# EAGLE design TSOP_to_DIP_adapter (EAGLE 7.6.0)
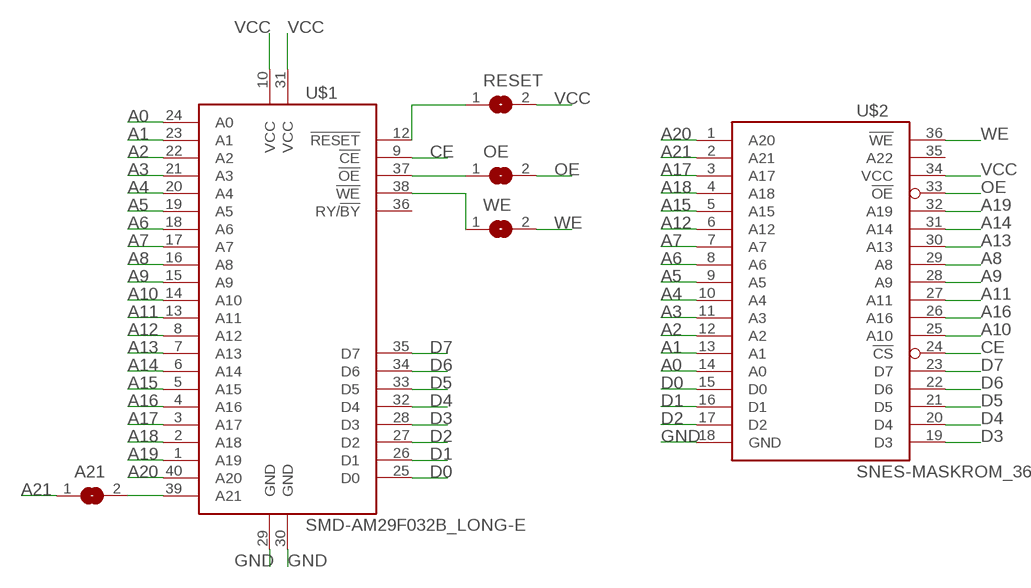
[diagram p0: schematic, sheet 1]

## Parts
A21  SMD-SOLDER_JUMPER_2  [SJ]
OE  SMD-SOLDER_JUMPER_2  [SJ]
RESET  SMD-SOLDER_JUMPER_2  [SJ]
U$1  SMD-AM29F032B_LONG-E  [40-TSOP_LONG]
U$2  SNES-MASKROM_36  [36-PDIP]
WE  SMD-SOLDER_JUMPER_2  [SJ]

## Nets
A0: U$1.24(A0) U$2.14(A0)
A1: U$1.23(A1) U$2.13(A1)
A2: U$1.22(A2) U$2.12(A2)
A3: U$1.21(A3) U$2.11(A3)
A4: U$1.20(A4) U$2.10(A4)
A5: U$1.19(A5) U$2.9(A5)
A6: U$1.18(A6) U$2.8(A6)
A7: U$1.17(A7) U$2.7(A7)
A8: U$1.16(A8) U$2.29(A8)
A9: U$1.15(A9) U$2.28(A9)
A10: U$1.14(A10) U$2.25(A10)
A11: U$1.13(A11) U$2.27(A11)
A12: U$1.8(A12) U$2.6(A12)
A13: U$1.7(A13) U$2.30(A13)
A14: U$1.6(A14) U$2.31(A14)
A15: U$1.5(A15) U$2.5(A15)
A16: U$1.4(A16) U$2.26(A16)
A17: U$1.3(A17) U$2.3(A17)
A18: U$1.2(A18) U$2.4(A18)
A19: U$1.1(A19) U$2.32(A19)
A20: U$1.40(A20) U$2.1(A20)
A21: A21.1 U$2.2(A21)
CE: U$1.9(!CE) U$2.24(!CS)
D0: U$1.25(D0) U$2.15(D0)
D1: U$1.26(D1) U$2.16(D1)
D2: U$1.27(D2) U$2.17(D2)
D3: U$1.28(D3) U$2.19(D3)
D4: U$1.32(D4) U$2.20(D4)
D5: U$1.33(D5) U$2.21(D5)
D6: U$1.34(D6) U$2.22(D6)
D7: U$1.35(D7) U$2.23(D7)
GND: U$1.29(GND) U$1.30(GND) U$2.18(GND)
N$1: OE.1 U$1.37(!OE)
N$2: RESET.1 U$1.12(!RESET)
N$3: A21.2 U$1.39(A21)
N$4: U$1.38(!WE) WE.1
OE: OE.2 U$2.33(!OE)
VCC: RESET.2 U$1.10(VCC) U$1.31(VCC) U$2.34(VCC)
WE: U$2.36(!WE) WE.2
Unconnected: U$1.36(RY/!BY) U$2.35(A22)

## Library data of the parts
A21 OE RESET WE = !sanni:SMD-SOLDER_JUMPER_2: SMD solder JUMPER
U$1 = !sanni:SMD-AM29F032B_LONG: 32MBit 5V Flash ROM (4M x 8) Manufactured by AMD, Spansion
U$2 = !sanni:SNES-MASKROM_36: 36-pin SNES MaskROM

## Net classes
0 default: width 0.254 mm, drill 0.305 mm, clearance 0.203 mm

## Board
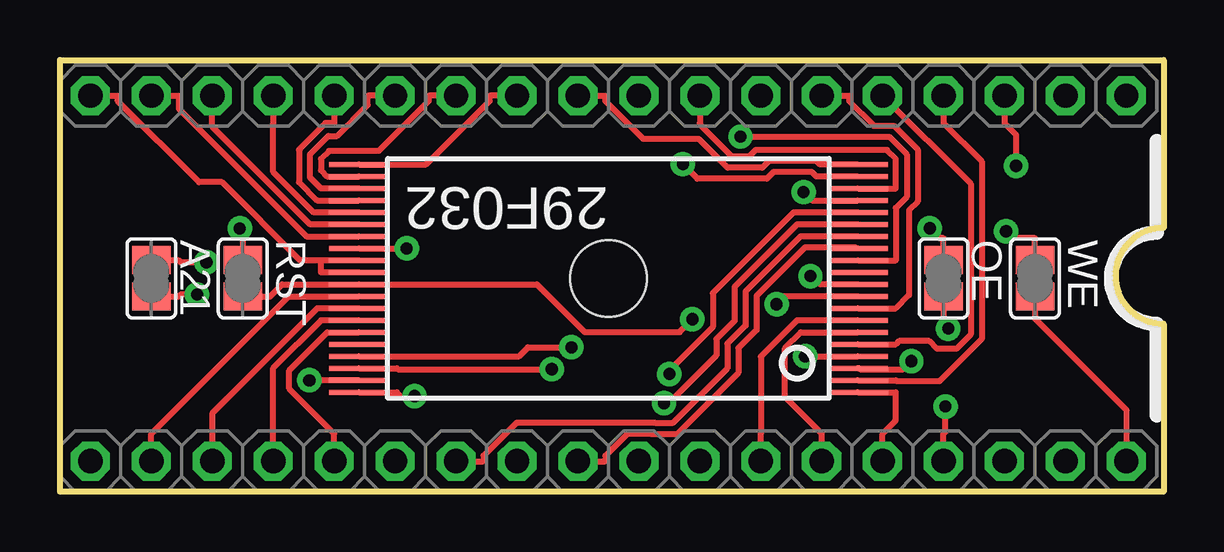
[diagram p1: board, top side]
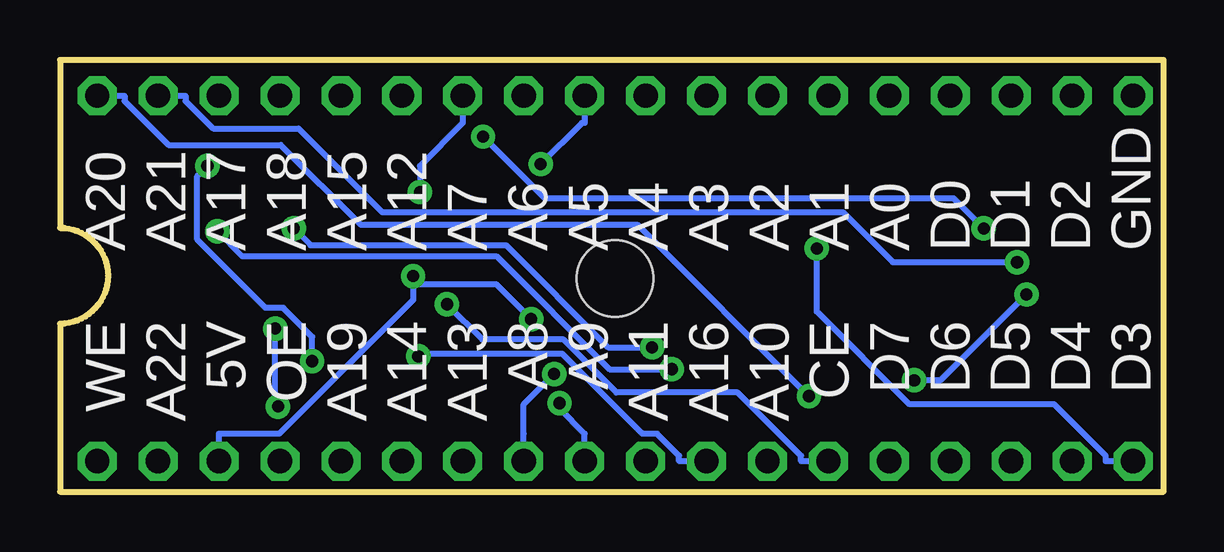
[diagram p2: board, bottom side, seen from below]

Size 46 x 18 mm. Coordinates in mm from the lower left corner, seen from the top.
Outline: 0,0 0,18 46,18 46,11 arc90 44,9 arc90 46,7 46,0 0,0
Copper layers (1*16): Top 0.035mm / dielectric 1.5mm / Bottom 0.035mm
Design rules "SparkFun_small": minimum track width 8mil, minimum drill 12mil, track to track 8mil, track to pad 8mil, pad to pad 8mil, via to via 8mil, smd to smd 8mil, copper to edge 20mil, drill to drill 12mil, minimum pad ring 12mil, minimum via ring 10mil, stop-mask expansion 4mil, vias tented up to drill 25mil, thermal gap 10mil
Holes 3.2 mm at 22.86,8.89

### Footprints (pad centres in the part's own frame; a part is rotated, then mirrored left to right if it is on the bottom)
SJ = smd 1.168 x 1.6: 1 -0.762,0; 2 0.762,0
40-TSOP_LONG = smd 2.5 x 0.2: 1 -10.4,4.75; 2 -10.4,4.25; 3 -10.4,3.75; 4 -10.4,3.25; 5 -10.4,2.75; 6 -10.4,2.25; 7 -10.4,1.75; 8 -10.4,1.25; 9 -10.4,0.75; 10 -10.4,0.25; 11 -10.4,-0.25; 12 -10.4,-0.75; 13 -10.4,-1.25; 14 -10.4,-1.75; 15 -10.4,-2.25; 16 -10.4,-2.75; 17 -10.4,-3.25; 18 -10.4,-3.75; 19 -10.4,-4.25; 20 -10.4,-4.75; 21 10.4,-4.75; 22 10.4,-4.25; 23 10.4,-3.75; 24 10.4,-3.25; 25 10.4,-2.75; 26 10.4,-2.25; 27 10.4,-1.75; 28 10.4,-1.25; 29 10.4,-0.75; 30 10.4,-0.25; 31 10.4,0.25; 32 10.4,0.75; 33 10.4,1.25; 34 10.4,1.75; 35 10.4,2.25; 36 10.4,2.75; 37 10.4,3.25; 38 10.4,3.75; 39 10.4,4.25; 40 10.4,4.75
36-PDIP = drill 1.016 octagon: 1 21.59,7.62; 2 19.05,7.62; 3 16.51,7.62; 4 13.97,7.62; 5 11.43,7.62; 6 8.89,7.62; 7 6.35,7.62; 8 3.81,7.62; 9 1.27,7.62; 10 -1.27,7.62; 11 -3.81,7.62; 12 -6.35,7.62; 13 -8.89,7.62; 14 -11.43,7.62; 15 -13.97,7.62; 16 -16.51,7.62; 17 -19.05,7.62; 18 -21.59,7.62; 19 -21.59,-7.62; 20 -19.05,-7.62; 21 -16.51,-7.62; 22 -13.97,-7.62; 23 -11.43,-7.62; 24 -8.89,-7.62; 25 -6.35,-7.62; 26 -3.81,-7.62; 27 -1.27,-7.62; 28 1.27,-7.62; 29 3.81,-7.62; 30 6.35,-7.62; 31 8.89,-7.62; 32 11.43,-7.62; 33 13.97,-7.62; 34 16.51,-7.62; 35 19.05,-7.62; 36 21.59,-7.62

### Placement (x,y rotation side)
A21  3.81,8.89 270 top
OE  36.83,8.89 270 top
RESET  7.62,8.89 270 top
U$1  22.86,8.89 180 top
U$2  22.86,8.89 0 top
WE  40.64,8.89 270 top

### Tracks (layer width: path | path; a pad name or v marks a point on that pad's centre or on a via)
A0
  Top 0.254: U$2.14 11.43,15.37 11.07,15.37 9.96,14.26 9.96,12.91 10.73,12.14 U$1.24
A1
  Top 0.254: U$2.13 12.83,16.51 12.83,16.12 11.54,14.83 11.19,14.83 10.42,14.07 10.42,13.1 10.88,12.64 U$1.23
A2
  Top 0.254: U$2.12 15.37,16.51 15.37,16.29 13.29,14.21 11.21,14.21 10.88,13.88 10.88,13.4 11.14,13.14 U$1.22
A3
  Top 0.254: U$2.11 17.91,16.51 17.91,16.29 15.26,13.64 U$1.21
A4
  Top 0.254: U$1.20 31.68,13.64 31.54,13.79 29.56,13.79 29.28,13.51 27.83,13.51 26.62,14.71 24.32,14.71 22.73,16.29 22.73,16.51 U$2.10
A5  (via drill 0.51 pad 1.02)
  Top 0.254: v25.96,13.65 26.57,13.05 29.47,13.05 29.75,13.33 31.34,13.33 31.53,13.14 31.68,13.14 U$1.19
  Bottom 0.254: v25.96,13.65 24.25,15.37 24.13,15.37 U$2.9
A6
  Top 0.254: U$1.18 34.84,12.64 34.84,13.88 34.48,14.24 28.99,14.24 28.71,13.96 28.02,13.96 26.67,15.31 26.67,15.37 U$2.8
A7  (via drill 0.51 pad 1.02)
  Top 0.254: v31,12.49 31.34,12.14 U$1.17
  Bottom 0.254: U$2.7 29.21,15.37 31,13.58 v31,12.49
A8  (via drill 0.51 pad 1.02)
  Top 0.254: U$1.16 30.58,11.64 27.22,8.28 27.22,6.86 25.4,5.05 v25.4,4.9
  Bottom 0.254: v25.4,4.9 26.67,3.64 26.67,2.41 U$2.29
A9  (via drill 0.51 pad 1.02)
  Top 0.254: U$1.15 30.72,11.14 28.12,8.54 28.12,7.12 27.36,6.36 27.36,5.68 25.37,3.68 v25.18,3.68
  Bottom 0.254: v25.18,3.68 25.18,3.46 24.13,2.41 U$2.28
A10
  Top 0.254: U$1.14 31.68,10.64 30.87,10.64 28.57,8.35 28.57,6.92 27.82,6.17 27.82,5.14 25.52,2.85 24.83,2.85 24.8,2.87 19.03,2.87 17.65,1.5 17.65,1.27 U$2.25
A11
  Top 0.2: 33.16,10.18 | 33.16,10.18 33.2,10.14
  Top 0.254: 33.16,10.18 31.06,10.18 29.03,8.16 29.03,6.74 28.28,5.98 28.28,4.95 25.71,2.39 24.64,2.39 24.62,2.41 23.65,2.41 22.73,1.49 22.73,1.27 U$2.27 | U$1.13 33.2,10.14
A12
  Top 0.254: U$2.6 32.89,16.51 32.89,16.29 33.92,15.26 34.76,15.26 35.76,14.26 35.76,12.1 35.4,11.74 35.4,8.19 34.84,7.64 U$1.8
A13
  Top 0.254: U$1.7 31.68,7.14 30.72,7.14 29.21,5.63 29.21,2.41 U$2.30
A14
  Top 0.254: U$2.31 31.75,2.41 30.22,3.94 30.22,5.99 30.88,6.64 U$1.6
A15
  Top 0.254: U$2.5 37.97,12.84 37.97,6.55 37.37,5.96 36.55,5.96 36.24,6.27 34.97,6.27 34.84,6.14 U$1.5
A16  (via drill 0.51 pad 1.02)
  Top 0.254: v31.06,5.64 U$1.4
  Bottom 0.254: v31.06,5.64 30.95,5.75 25.06,5.75 21.73,2.41 21.11,2.41 20.19,1.49 20.19,1.27 U$2.26
A17  (via drill 0.51 pad 1.02)
  Top 0.2: 33.36,5.1 | 33.36,5.1 33.32,5.14
  Top 0.254: 33.36,5.1 35.15,5.1 v35.49,5.43 | U$2.3 39.37,15.37 39.85,14.88 v39.85,13.58 | U$1.3 33.32,5.14
  Bottom 0.254: v35.49,5.43 35.49,6.45 36.69,7.66 37.43,7.66 40.28,10.51 40.28,13.16 v39.85,13.58
A18
  Top 0.254: U$1.2 34.84,4.64 34.88,4.6 36.66,4.6 38.42,6.36 38.42,13.78 36.83,15.37 U$2.4
A19
  Top 0.254: U$2.32 34.29,2.41 34.84,2.96 34.84,4.14 U$1.1
A20  (via drill 0.51 pad 1.02)
  Top 0.254: v14.78,3.98 14.2,3.98 14.04,4.14 U$1.40
  Bottom 0.254: v14.78,3.98 21.93,11.12 33.47,11.12 36.8,14.45 41.47,14.45 43.31,16.29 43.31,16.51 U$2.1
A21  (via drill 0.51 pad 1.02)
  Top 0.254: v6.1,9.56 5.03,9.56 4.94,9.65 A21.1
  Bottom 0.254: U$2.2 40.77,16.51 40.77,16.29 39.62,15.14 36.06,15.14 32.57,11.65 13.37,11.65 11.28,9.56 v6.1,9.56
CE  (via drill 0.51 pad 1.02)
  Top 0.254: U$1.9 30.2,8.14 v29.87,7.81
  Bottom 0.254: v29.87,7.81 28.39,6.33 25,6.33 22.8,4.13 17.75,4.13 15.11,1.49 15.11,1.27 U$2.24
D0
  Top 0.254: U$1.25 10.58,11.64 8.89,13.33 8.89,15.37 U$2.15
D1
  Top 0.254: U$2.16 6.35,15.22 10.43,11.14 10.88,11.14 U$1.26
D2
  Top 0.254: U$2.17 4.95,16.51 4.95,15.97 10.28,10.64 U$1.27
D3  (via drill 0.51 pad 1.02)
  Top 0.254: v14.45,10.14 14.04,10.14 U$1.28
  Bottom 0.254: v14.45,10.14 14.45,7.51 10.59,3.64 4.56,3.64 2.41,1.49 2.41,1.27 U$2.19
D4
  Top 0.254: U$2.20 3.81,2.41 9.54,8.14 U$1.32
D5
  Top 0.254: U$1.33 10.73,7.64 6.35,3.26 U$2.21
D6
  Top 0.254: U$1.34 10.88,7.14 8.89,5.15 U$2.22
D7
  Top 0.254: U$1.35 11.14,6.64 9.56,5.06 9.56,4.28 11.43,2.41 U$2.23
GND
  Top 0.254: 10.88,9.64 10.01,9.64 6.75,12.9 5.8,12.9 2.41,16.29 2.41,16.51 U$2.18 | 10.88,9.64 10.88,9.14 U$1.30 | 10.88,9.64 11.08,9.64 U$1.29
N$1  (via drill 0.51 pad 1.02)
  Top 0.254: U$1.37 19.13,5.64 19.5,6.02 v21.32,6.02 | v36.26,10.98 36.67,10.57 36.83,10.57 OE.1
  Bottom 0.254: v36.26,10.98 35.56,10.28 27.41,10.28 23.15,6.02 v21.32,6.02
N$2  (via drill 0.51 pad 1.02)
  Top 0.254: v7.5,10.97 7.62,10.85 RESET.1 | v28.36,14.8 34.57,14.8 35.3,14.07 35.3,12.29 34.84,11.83 34.84,9.64 U$1.12
  Bottom 0.254: v28.36,14.8 25.8,12.23 8.76,12.23 v7.5,10.97
N$3  (via drill 0.51 pad 1.02)
  Top 0.254: v10.4,4.64 10.88,4.64 U$1.39 | A21.2 4.94,8.13 5.03,8.22 v5.71,8.22
  Bottom 0.254: v5.71,8.22 9.29,4.64 v10.4,4.64
N$4  (via drill 0.51 pad 1.02)
  Top 0.254: v39.44,10.86 39.73,10.57 40.64,10.57 WE.1 | v20.5,5.1 14.08,5.1 14.04,5.14 U$1.38
  Bottom 0.254: v39.44,10.86 38.4,9.82 27.81,9.82 23.09,5.1 v20.5,5.1
OE  (via drill 0.51 pad 1.02)
  Top 0.254: U$2.33 36.83,2.41 36.91,2.49 v36.91,3.55 | v37.03,6.8 37.03,7.02 36.83,7.21 OE.2
  Bottom 0.254: v36.91,3.55 37.03,3.67 v37.03,6.8
VCC  (via drill 0.51 pad 1.02)
  Top 0.254: v26.36,7.19 25.83,6.66 21.87,6.66 19.89,8.64 U$1.31 9.26,8.64 8.75,8.13 RESET.2 | v31.28,8.98 31.34,8.98 31.68,8.64 U$1.10
  Bottom 0.254: 31.28,8.65 31.28,7.99 36.86,2.41 39.37,2.41 U$2.34 | v31.28,8.98 31.28,8.65 | 31.28,8.65 27.82,8.65 v26.36,7.19
WE
  Top 0.254: WE.2 40.64,7.21 44.45,3.4 U$2.36

### Text on the board
tNames: 29F032 | A21 | RST | OE | WE
bNames: A20 / A21 / A17 / A18 / A15 / A12 / A7 / A6 / A5 / A4 / A3 / A2 / A1 / A0 / D0 / D1 / D2 / GND | WE / A22 / 5V / OE / A19 / A14 / A13 / A8 / A9 / A11 / A16 / A10 / CE / D7 / D6 / D5 / D4 / D3